# EAGLE design arpie_max (EAGLE 5.10)

## Sheet 1 of 3
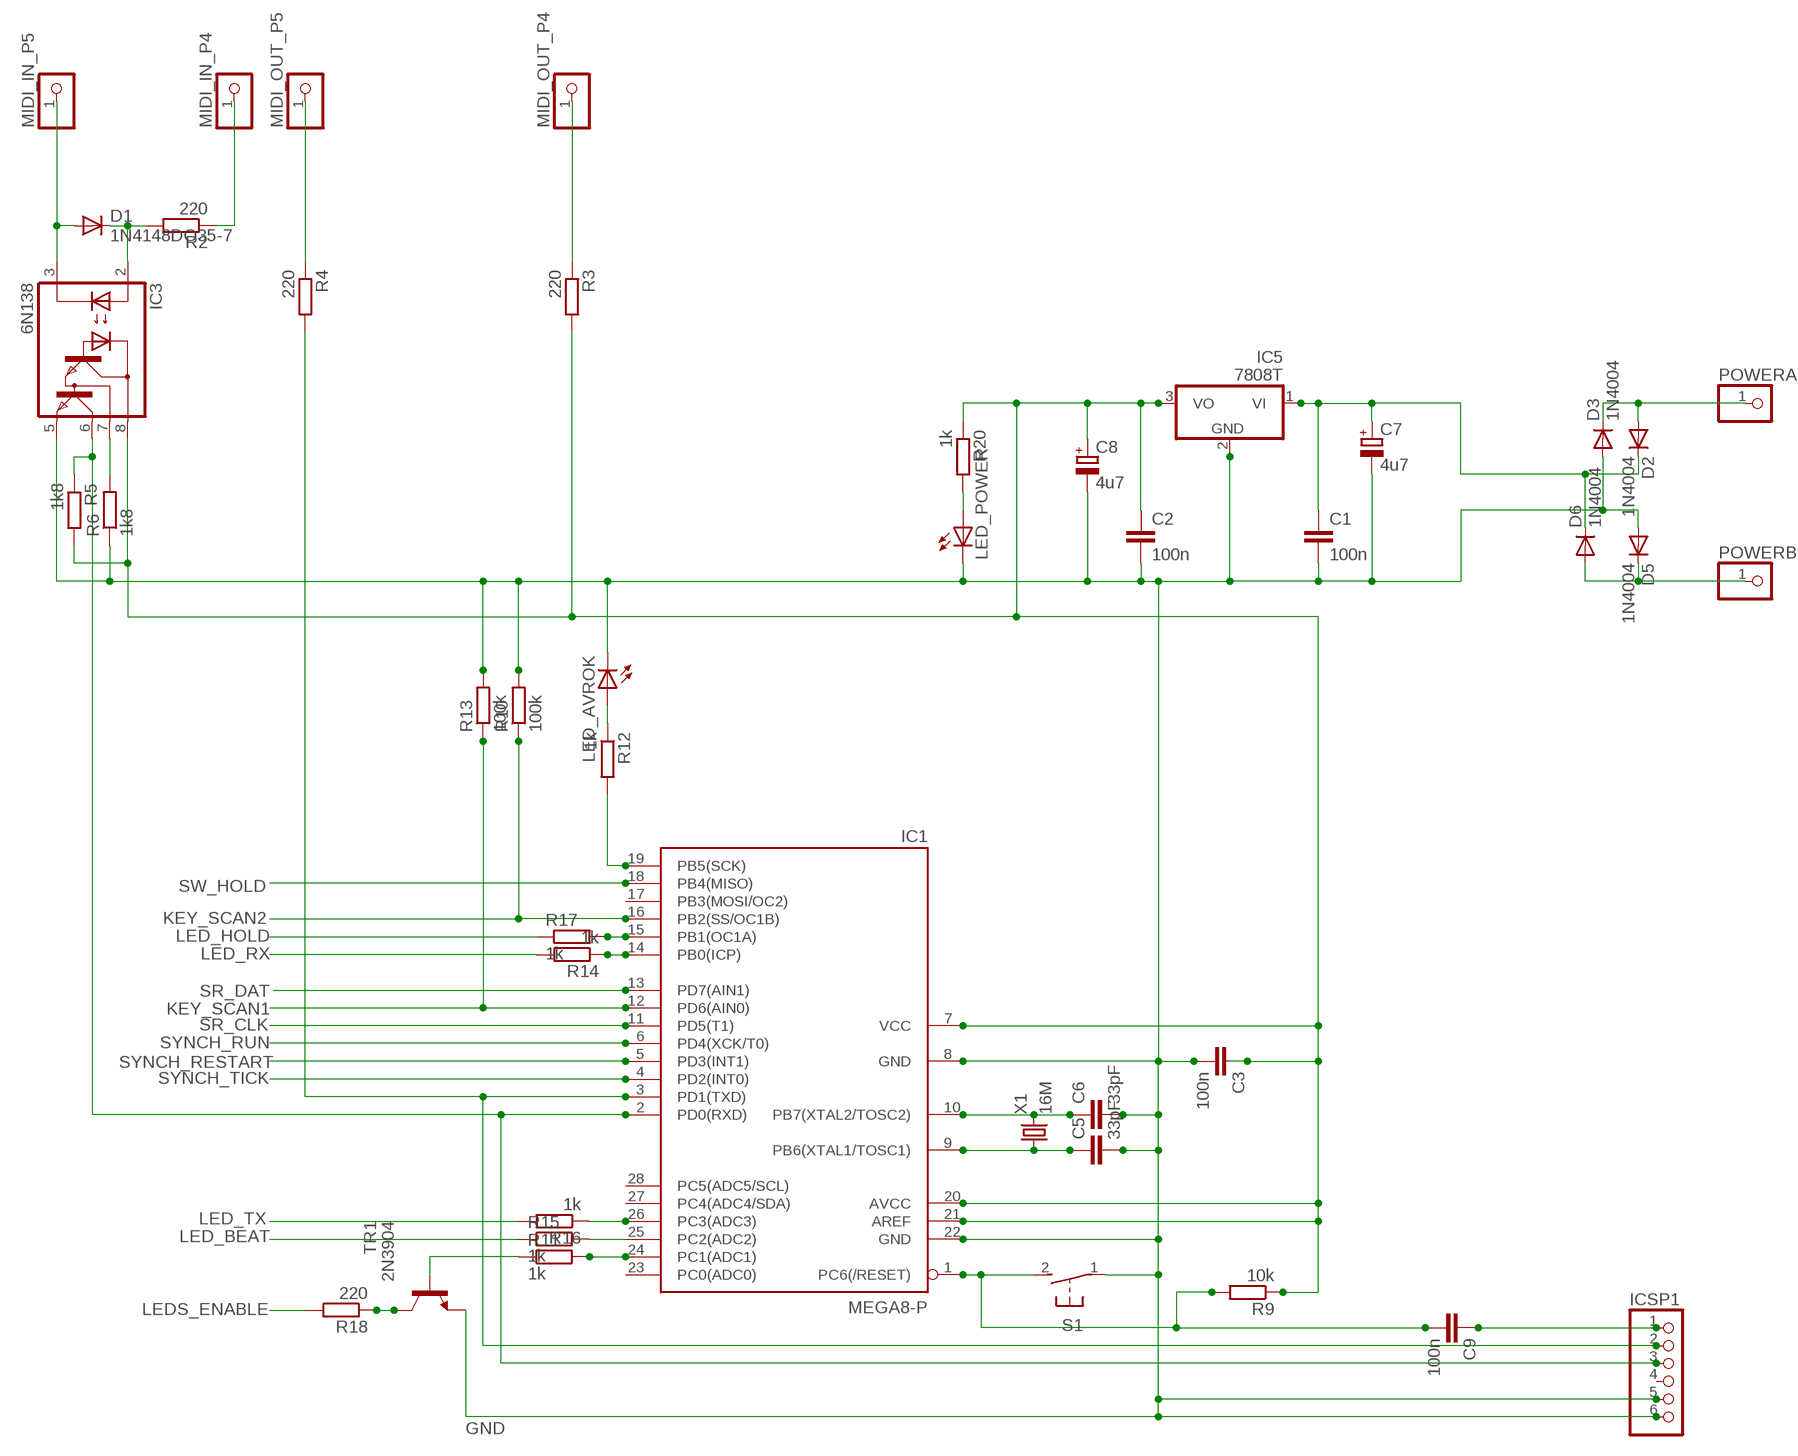
[diagram p0: schematic, sheet 1]

### Parts
C1  100n  C-EU025-024X044  [C025-024X044]
C2  100n  C-EU025-024X044  [C025-024X044]
C3  100n  C-EU025-024X044  [C025-024X044]
C5  33pF  C-EU025-024X044  [C025-024X044]
C6  33pF  C-EU025-024X044  [C025-024X044]
C7  4u7  CPOL-EUE2.5-7  [E2,5-7]
C8  4u7  CPOL-EUE2.5-7  [E2,5-7]
C9  100n  C-EU025-024X044  [C025-024X044]
D1  1N4148DO35-7  [DO35-7]
D2  1N4004  [DO41-10]
D3  1N4004  [DO41-10]
D5  1N4004  [DO41-10]
D6  1N4004  [DO41-10]
IC1  MEGA8-P  [DIL28-3]
IC3  6N138  [DIL08]
IC5  7808T  [TO220H]
ICSP1  PINHD-1X6  [1X06]
LED_AVROK  LED3MM  [LED3MM]
LED_POWER  LED5MM  [LED5MM]
MIDI_IN_P4  PINHD-1X1  [1X01]
MIDI_IN_P5  PINHD-1X1  [1X01]
MIDI_OUT_P4  PINHD-1X1  [1X01]
MIDI_OUT_P5  PINHD-1X1  [1X01]
POWERA  PINHD-1X1  [1X01]
POWERB  PINHD-1X1  [1X01]
R2  220  R-EU_0207/7  [0207/7]
R3  220  R-EU_0207/7  [0207/7]
R4  220  R-EU_0207/7  [0207/7]
R5  1k8  R-EU_0207/7  [0207/7]
R6  1k8  R-EU_0207/7  [0207/7]
R9  10k  R-EU_0207/7  [0207/7]
R10  100k  R-EU_0207/7  [0207/7]
R11  1k  R-EU_0207/7  [0207/7]
R12  1k  R-EU_0207/7  [0207/7]
R13  100k  R-EU_0207/7  [0207/7]
R14  1k  R-EU_0207/7  [0207/7]
R15  1k  R-EU_0207/7  [0207/7]
R16  1k  R-EU_0207/7  [0207/7]
R17  1k  R-EU_0207/7  [0207/7]
R18  220  R-EU_0207/7  [0207/7]
R20  1k  R-EU_0207/7  [0207/7]
S1  31-XX  [B3F-31XX]
TR1  2N3904  [TO92]
X1  16M  CRYSTALHC49S  [HC49/S]

### Nets
GND: C1.2 C2.2 C3.2 C5.2 C6.2 C7.- C8.- D3.A D5.A IC1.8(GND) IC1.22(GND) IC3.5(GND) IC5.2(GND) ICSP1.5 ICSP1.6 LED_AVROK.K(C) LED_POWER.K(C) R6.1 R10.2 R13.2 S1.1(P) TR1.3(E) ; also sheet 2,3
KEY_SCAN1: IC1.12(PD6(AIN0)) R13.1 ; also sheet 2
KEY_SCAN2: IC1.16(PB2(SS/OC1B)) R10.1 ; also sheet 2
LED_BEAT: R15.1 ; also sheet 2
LED_HOLD: R17.1 ; also sheet 2
LED_RX: R14.2 ; also sheet 2
LED_TX: R16.2 ; also sheet 2
LEDS_ENABLE: R18.2 ; also sheet 2
N$1: D1.A IC3.3(C) MIDI_IN_P5.1
N$2: D1.C IC3.2(A) R2.2
N$3: MIDI_IN_P4.1 R2.1
N$4: R11.1 TR1.2(B)
N$5: D5.C D6.A POWERB.1
N$6: IC1.25(PC2(ADC2)) R15.2
N$7: IC1.2(PD0(RXD)) IC3.6(VO) ICSP1.3 R5.1
N$8: IC3.7(VB) R6.2
N$9: C9.1 ICSP1.1
N$11: MIDI_OUT_P5.1 R4.1
N$12: IC1.3(PD1(TXD)) ICSP1.2 R4.2
N$13: MIDI_OUT_P4.1 R3.1
N$14: R18.1 TR1.1(C)
N$19: LED_POWER.A R20.2
N$35: IC1.26(PC3(ADC3)) R16.1
N$36: C6.1 IC1.10(PB7(XTAL2/TOSC2)) X1.2
N$37: C5.1 IC1.9(PB6(XTAL1/TOSC1)) X1.1
N$38: C9.2 IC1.1(PC6(/RESET)) R9.2 S1.2(S)
N$43: IC1.24(PC1(ADC1)) R11.2
N$44: IC1.14(PB0(ICP)) R14.1
N$48: IC1.19(PB5(SCK)) R12.2
N$50: LED_AVROK.A R12.1
N$54: D2.A D3.C POWERA.1
N$55: IC1.15(PB1(OC1A)) R17.2
SR_CLK: IC1.11(PD5(T1)) ; also sheet 2
SR_DAT: IC1.13(PD7(AIN1)) ; also sheet 2
SW_HOLD: IC1.18(PB4(MISO)) ; also sheet 2
SYNCH_RESTART: IC1.5(PD3(INT1)) ; also sheet 3
SYNCH_RUN: IC1.6(PD4(XCK/T0)) ; also sheet 3
SYNCH_TICK: IC1.4(PD2(INT0)) ; also sheet 3
VCC: C2.1 C3.1 C8.+ IC1.7(VCC) IC1.20(AVCC) IC1.21(AREF) IC3.8(VCC) IC5.3(VO) R3.2 R5.2 R9.1 R20.1 ; also sheet 2,3
VIN: C1.1 C7.+ D2.C D6.C IC5.1(VI)
Unconnected: IC1.17(PB3(MOSI/OC2)) IC1.23(PC0(ADC0)) IC1.27(PC4(ADC4/SDA)) IC1.28(PC5(ADC5/SCL)) ICSP1.4

## Sheet 2 of 3
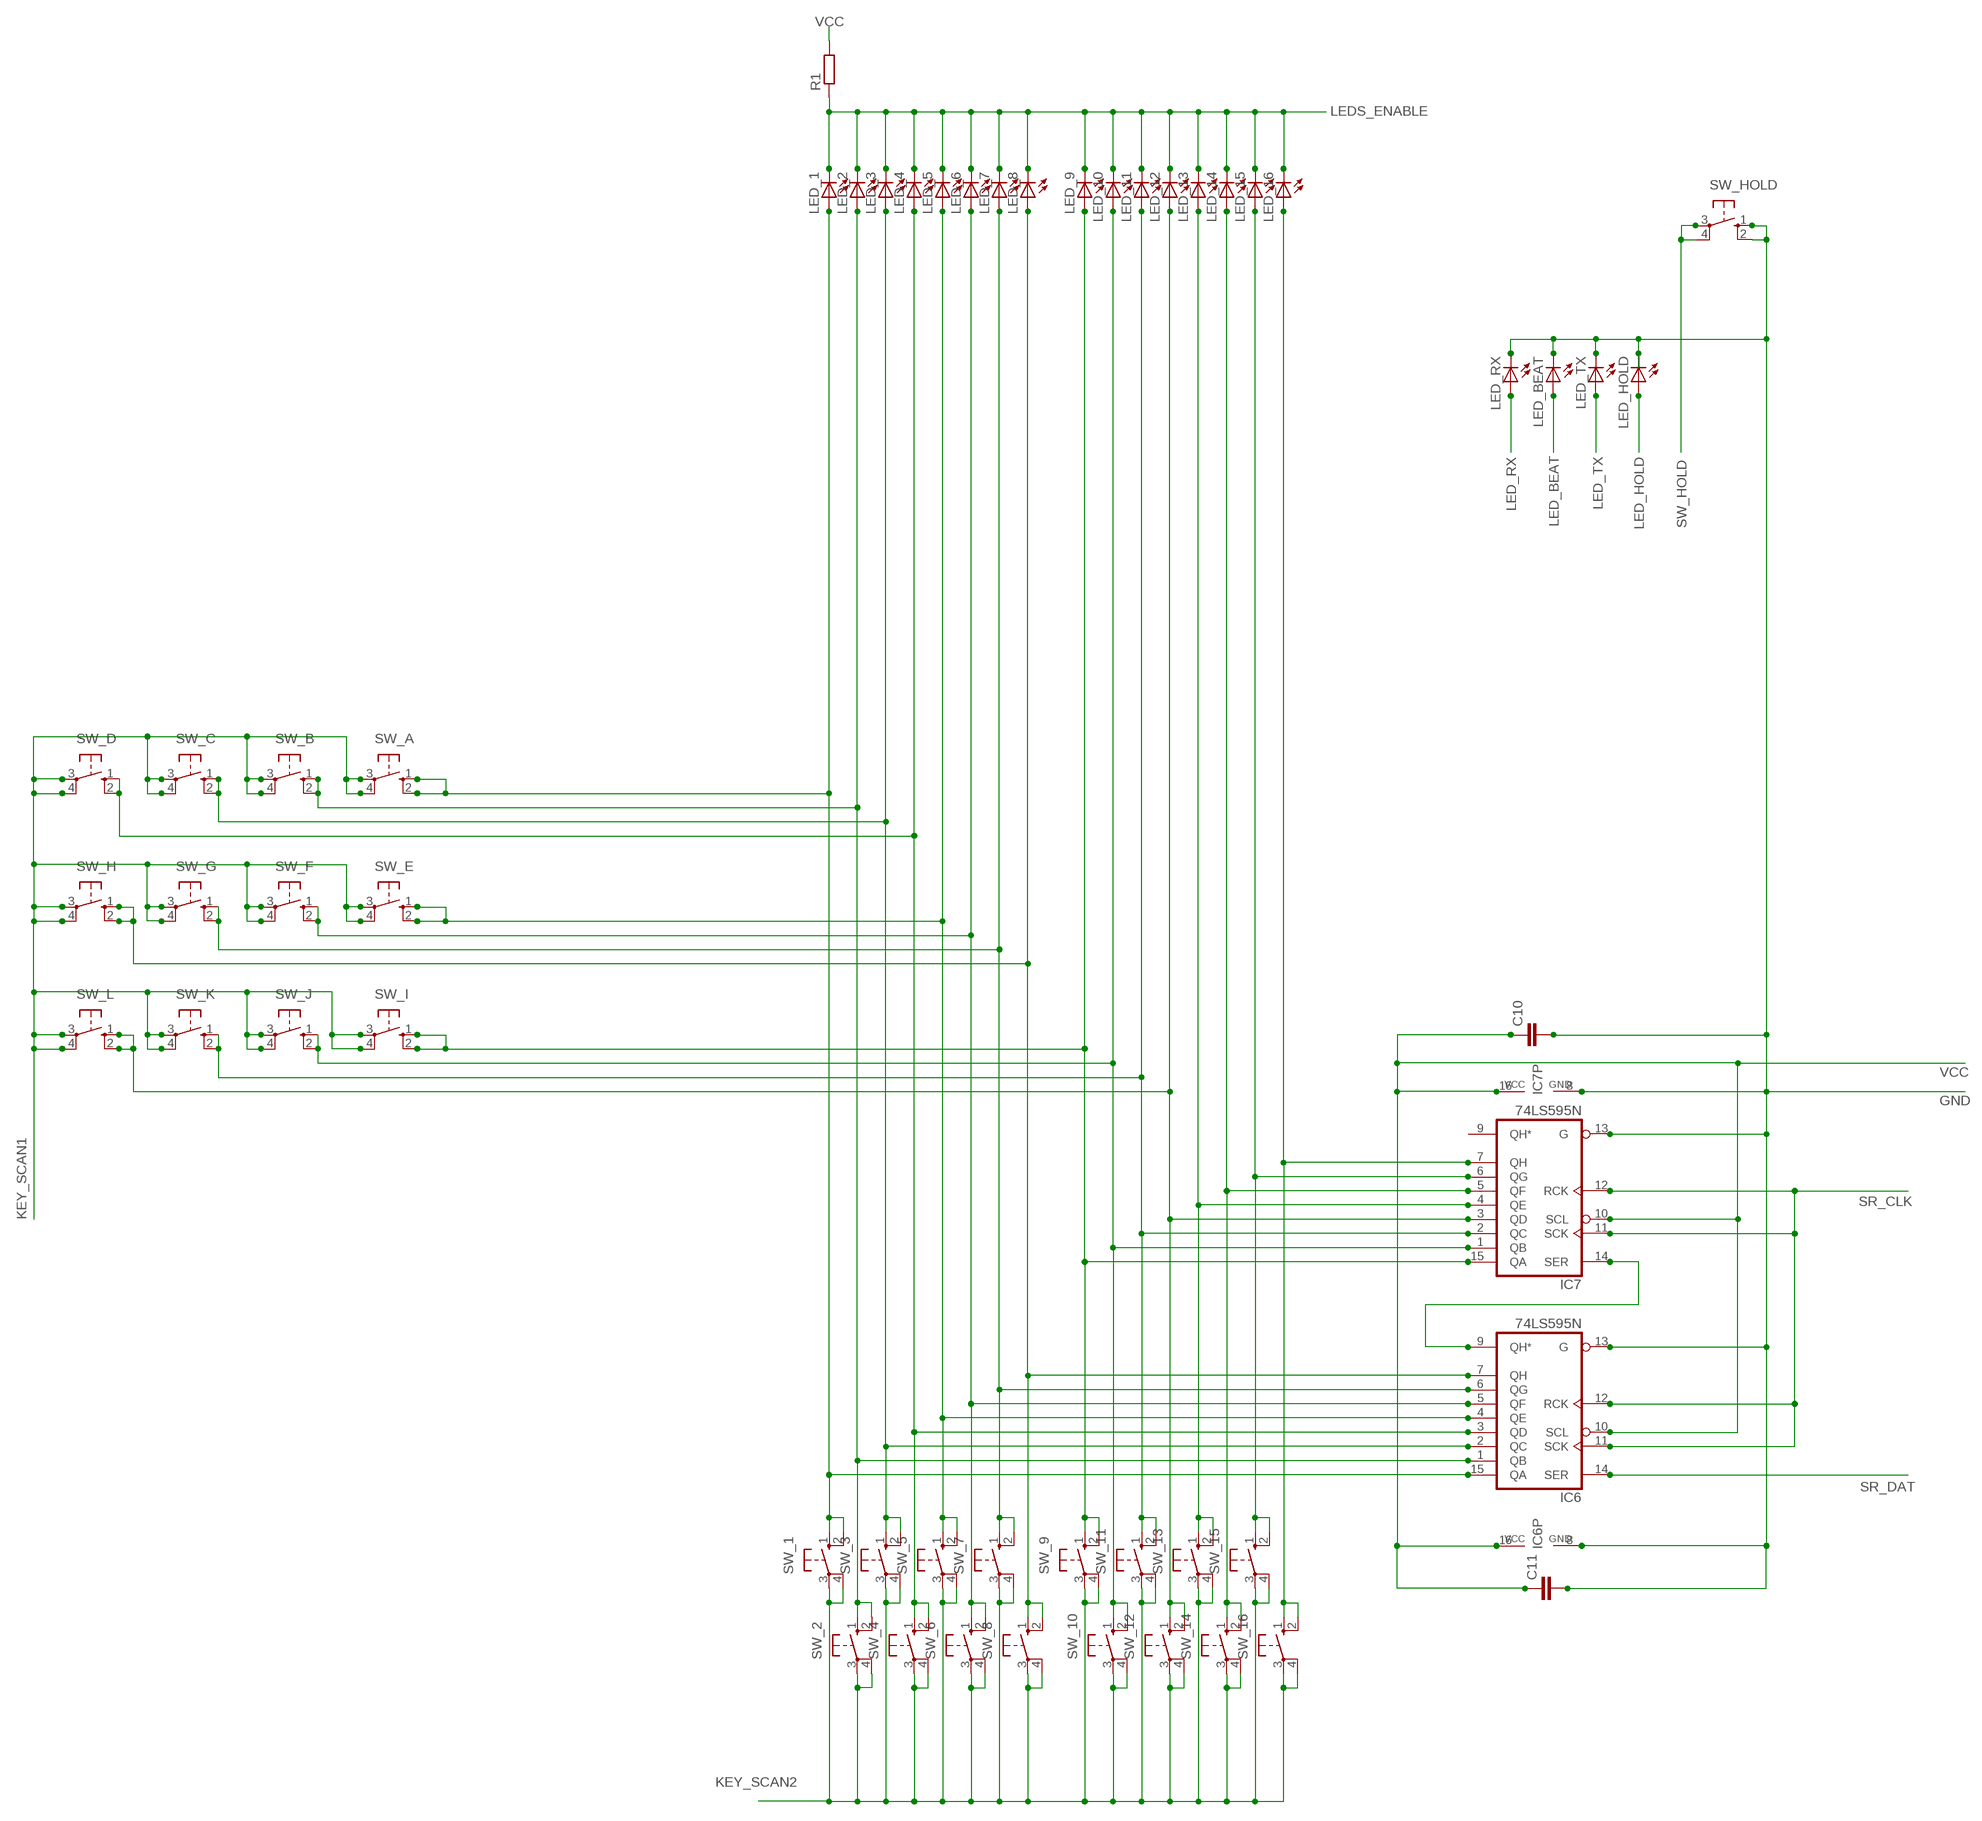
[diagram p1: schematic, sheet 2]

### Parts
C10  C-EU025-025X050  [C025-025X050]
C11  C-EU025-025X050  [C025-025X050]
IC6  74LS595N  [DIL16]
IC7  74LS595N  [DIL16]
LED_1  LED5MM  [LED5MM]
LED_2  LED5MM  [LED5MM]
LED_3  LED5MM  [LED5MM]
LED_4  LED5MM  [LED5MM]
LED_5  LED5MM  [LED5MM]
LED_6  LED5MM  [LED5MM]
LED_7  LED5MM  [LED5MM]
LED_8  LED5MM  [LED5MM]
LED_9  LED5MM  [LED5MM]
LED_10  LED5MM  [LED5MM]
LED_11  LED5MM  [LED5MM]
LED_12  LED5MM  [LED5MM]
LED_13  LED5MM  [LED5MM]
LED_14  LED5MM  [LED5MM]
LED_15  LED5MM  [LED5MM]
LED_16  LED5MM  [LED5MM]
LED_BEAT  LED5MM  [LED5MM]
LED_HOLD  LED5MM  [LED5MM]
LED_RX  LED5MM  [LED5MM]
LED_TX  LED5MM  [LED5MM]
R1  R-EU_0207/7  [0207/7]
SW_1  10-XX  [B3F-10XX]
SW_2  10-XX  [B3F-10XX]
SW_3  10-XX  [B3F-10XX]
SW_4  10-XX  [B3F-10XX]
SW_5  10-XX  [B3F-10XX]
SW_6  10-XX  [B3F-10XX]
SW_7  10-XX  [B3F-10XX]
SW_8  10-XX  [B3F-10XX]
SW_9  10-XX  [B3F-10XX]
SW_10  10-XX  [B3F-10XX]
SW_11  10-XX  [B3F-10XX]
SW_12  10-XX  [B3F-10XX]
SW_13  10-XX  [B3F-10XX]
SW_14  10-XX  [B3F-10XX]
SW_15  10-XX  [B3F-10XX]
SW_16  10-XX  [B3F-10XX]
SW_A  40-XX  [B3F-40XX]
SW_B  40-XX  [B3F-40XX]
SW_C  40-XX  [B3F-40XX]
SW_D  40-XX  [B3F-40XX]
SW_E  40-XX  [B3F-40XX]
SW_F  40-XX  [B3F-40XX]
SW_G  40-XX  [B3F-40XX]
SW_H  40-XX  [B3F-40XX]
SW_HOLD  40-XX  [B3F-40XX]
SW_I  40-XX  [B3F-40XX]
SW_J  40-XX  [B3F-40XX]
SW_K  40-XX  [B3F-40XX]
SW_L  40-XX  [B3F-40XX]

### Nets
GND: C10.2 C11.2 IC6.8(GND) IC6.13(G) IC7.8(GND) IC7.13(G) LED_BEAT.K(C) LED_HOLD.K(C) LED_RX.K(C) LED_TX.K(C) SW_HOLD.1(S) SW_HOLD.2(S1) ; also sheet 1,3
KEY_SCAN1: SW_A.3(P) SW_A.4(P1) SW_B.3(P) SW_B.4(P1) SW_C.3(P) SW_C.4(P1) SW_D.3(P) SW_D.4(P1) SW_E.3(P) SW_E.4(P1) SW_F.3(P) SW_F.4(P1) SW_G.3(P) SW_G.4(P1) SW_H.3(P) SW_H.4(P1) SW_I.3(P) SW_I.4(P1) SW_J.3(P) SW_J.4(P1) SW_K.3(P) SW_K.4(P1) SW_L.3(P) SW_L.4(P1) ; also sheet 1
KEY_SCAN2: SW_1.3(P) SW_1.4(P1) SW_2.3(P) SW_2.4(P1) SW_3.3(P) SW_3.4(P1) SW_4.3(P) SW_4.4(P1) SW_5.3(P) SW_5.4(P1) SW_6.3(P) SW_6.4(P1) SW_7.3(P) SW_7.4(P1) SW_8.3(P) SW_8.4(P1) SW_9.3(P) SW_9.4(P1) SW_10.3(P) SW_10.4(P1) SW_11.3(P) SW_11.4(P1) SW_12.3(P) SW_12.4(P1) SW_13.3(P) SW_13.4(P1) SW_14.3(P) SW_14.4(P1) SW_15.3(P) SW_15.4(P1) SW_16.3(P) SW_16.4(P1) ; also sheet 1
LED_BEAT: LED_BEAT.A ; also sheet 1
LED_HOLD: LED_HOLD.A ; also sheet 1
LED_RX: LED_RX.A ; also sheet 1
LED_TX: LED_TX.A ; also sheet 1
LEDS_ENABLE: LED_1.K(C) LED_2.K(C) LED_3.K(C) LED_4.K(C) LED_5.K(C) LED_6.K(C) LED_7.K(C) LED_8.K(C) LED_9.K(C) LED_10.K(C) LED_11.K(C) LED_12.K(C) LED_13.K(C) LED_14.K(C) LED_15.K(C) LED_16.K(C) R1.1 ; also sheet 1
N$17: IC6.15(QA) LED_1.A SW_1.1(S) SW_1.2(S1) SW_A.1(S) SW_A.2(S1)
N$20: IC6.1(QB) LED_2.A SW_2.1(S) SW_2.2(S1) SW_B.1(S) SW_B.2(S1)
N$21: IC6.2(QC) LED_3.A SW_3.1(S) SW_3.2(S1) SW_C.1(S) SW_C.2(S1)
N$22: IC6.3(QD) LED_4.A SW_4.1(S) SW_4.2(S1) SW_D.1(S) SW_D.2(S1)
N$23: IC6.4(QE) LED_5.A SW_5.1(S) SW_5.2(S1) SW_E.1(S) SW_E.2(S1)
N$24: IC6.5(QF) LED_6.A SW_6.1(S) SW_6.2(S1) SW_F.1(S) SW_F.2(S1)
N$25: IC6.6(QG) LED_7.A SW_7.1(S) SW_7.2(S1) SW_G.1(S) SW_G.2(S1)
N$26: IC6.7(QH) LED_8.A SW_8.1(S) SW_8.2(S1) SW_H.1(S) SW_H.2(S1)
N$27: IC7.15(QA) LED_9.A SW_9.1(S) SW_9.2(S1) SW_I.1(S) SW_I.2(S1)
N$28: IC7.1(QB) LED_10.A SW_10.1(S) SW_10.2(S1) SW_J.1(S) SW_J.2(S1)
N$29: IC7.3(QD) LED_12.A SW_12.1(S) SW_12.2(S1) SW_L.1(S) SW_L.2(S1)
N$30: IC7.2(QC) LED_11.A SW_11.1(S) SW_11.2(S1) SW_K.1(S) SW_K.2(S1)
N$31: IC6.9(QH*) IC7.14(SER)
N$32: IC7.4(QE) LED_13.A SW_13.1(S) SW_13.2(S1)
N$34: IC7.5(QF) LED_14.A SW_14.1(S) SW_14.2(S1)
N$39: IC7.6(QG) LED_15.A SW_15.1(S) SW_15.2(S1)
N$40: IC7.7(QH) LED_16.A SW_16.1(S) SW_16.2(S1)
SR_CLK: IC6.11(SCK) IC6.12(RCK) IC7.11(SCK) IC7.12(RCK) ; also sheet 1
SR_DAT: IC6.14(SER) ; also sheet 1
SW_HOLD: SW_HOLD.3(P) SW_HOLD.4(P1) ; also sheet 1
VCC: C10.1 C11.1 IC6.10(SCL) IC6.16(VCC) IC7.10(SCL) IC7.16(VCC) R1.2 ; also sheet 1,3
Unconnected: IC7.9(QH*)

## Sheet 3 of 3
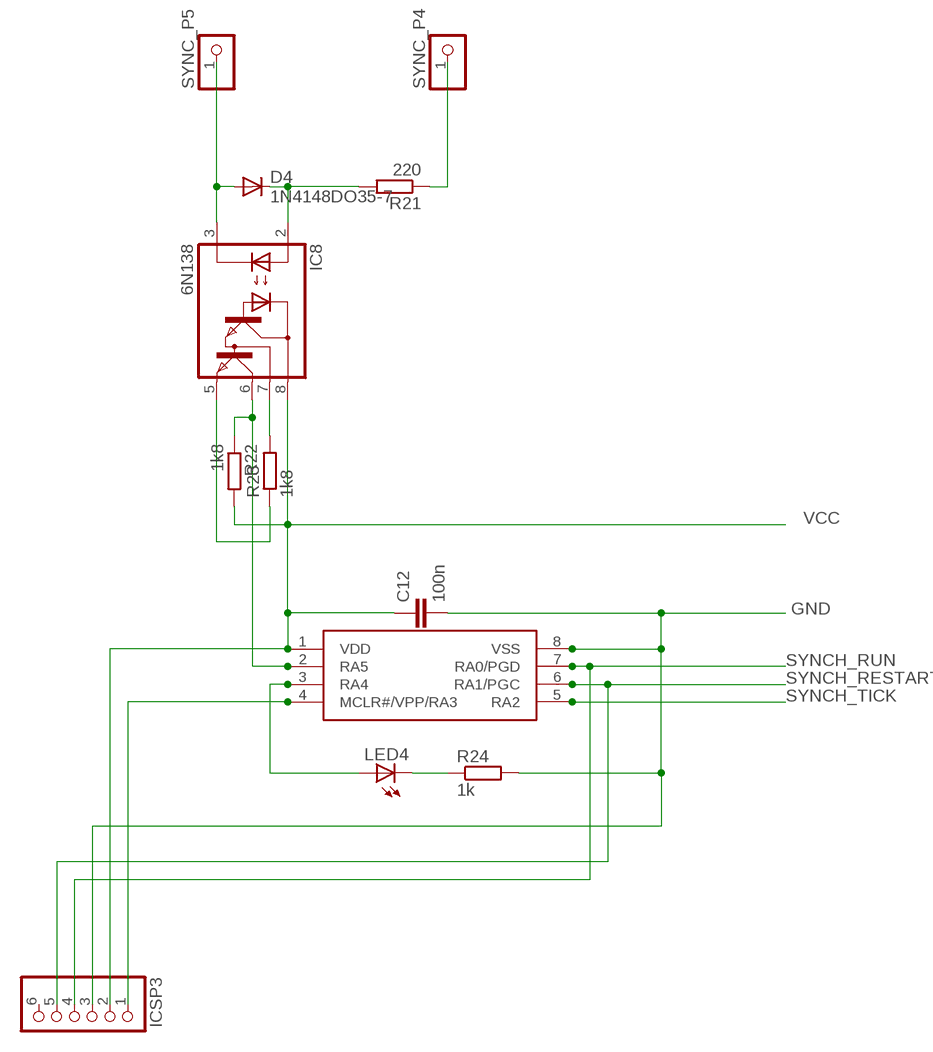
[diagram p2: schematic, sheet 3]

### Parts
C12  100n  C-EU025-024X044  [C025-024X044]
D4  1N4148DO35-7  [DO35-7]
IC8  6N138  [DIL08]
IC9  PIC12F1822  [DIL08]
ICSP3  PINHD-1X6  [1X06]
LED4  LED3MM  [LED3MM]
R21  220  R-EU_0207/7  [0207/7]
R22  1k8  R-EU_0207/7  [0207/7]
R23  1k8  R-EU_0207/7  [0207/7]
R24  1k  R-EU_0207/7  [0207/7]
SYNC_P4  PINHD-1X1  [1X01]
SYNC_P5  PINHD-1X1  [1X01]

### Nets
GND: C12.2 IC9.8(VSS) ICSP3.3 R24.2 ; also sheet 1,2
N$46: D4.A IC8.3(C) SYNC_P5.1
N$47: D4.C IC8.2(A) R21.2
N$49: R21.1 SYNC_P4.1
N$51: IC8.7(VB) R23.2
N$53: LED4.K(C) R24.1
N$57: IC8.6(VO) IC9.2(RA5) R22.1
N$58: IC9.3(RA4) LED4.A
N$59: IC9.4(MCLR#/VPP/RA3) ICSP3.1
N$60: IC8.5(GND) R23.1
SYNCH_RESTART: IC9.6(RA1/PGC) ICSP3.5 ; also sheet 1
SYNCH_RUN: IC9.7(RA0/PGD) ICSP3.4 ; also sheet 1
SYNCH_TICK: IC9.5(RA2) ; also sheet 1
VCC: C12.1 IC8.8(VCC) IC9.1(VDD) ICSP3.2 R22.2 ; also sheet 1,2
Unconnected: ICSP3.6

## Library data of the parts
C1-C3 C5 C6 C9-C12 = rcl:C-EU: CAPACITOR, European symbol
C7 C8 = rcl:CPOL-EU: POLARIZED CAPACITOR, European symbol
D1 D4 = diode:1N4148: DIODE high speed (Philips)
D2 D3 D5 D6 = adafruit:1N4004: DIODE General purpose 1N400x type rectifier (With bigger pads) http://www.ladyada.net/library/pcb/eaglelibrary.html
IC1 = atmel:MEGA8-P: MICROCONTROLLER 8 Kbytes FLASH, 1 kbytes SRAM, 512 bytes EEPROM, USART, 4-channel 10 bit ADC, 2-channel 8 bit ADC Pin compatible with Atmega48, ATMega88, ATMega168 Source: avr.lbr
IC3 IC8 = optocoupler:6N138: MOTOROLA OPTO COUPLER
IC5 = linear:78*: Positive VOLTAGE REGULATOR Source: http://cache.national.com/ds/LM/LM78L05.pdf http://www.fairchildsemi.com/ds/LM/LM7805.pdf
IC6 IC7 = 74xx-eu:74*595: 8-bit SHIFT REGISTER, output latch
IC9 = jasons_stuff:PIC12F1822
ICSP1 ICSP3 = adafruit:PINHD-1X6: PIN HEADER
LED4 LED_1-LED_16 LED_BEAT LED_HOLD LED_POWER LED_RX LED_TX = adafruit:LED: LED
LED_AVROK = led:LED: LED
MIDI_IN_P4 MIDI_IN_P5 MIDI_OUT_P4 MIDI_OUT_P5 POWERA POWERB = adafruit:PINHD-1X1: Pin header 1x1 for 0.1" spacing With round pins
R1-R6 R9-R18 R20-R24 = rcl:R-EU_: RESISTOR, European symbol
S1 = switch-omron:31-XX: OMRON SWITCH
SW_1-SW_16 = switch-omron:10-XX: OMRON SWITCH
SW_A SW_B SW_C SW_D SW_E SW_F SW_G SW_H SW_HOLD SW_I SW_J SW_K SW_L = switch-omron:40-XX: OMRON SWITCH
SYNC_P4 SYNC_P5 = pinhead:PINHD-1X1: PIN HEADER
TR1 = transistor:2N3904: NPN TRANSISTOR
X1 = crystal:CRYSTAL: CRYSTAL

## Board
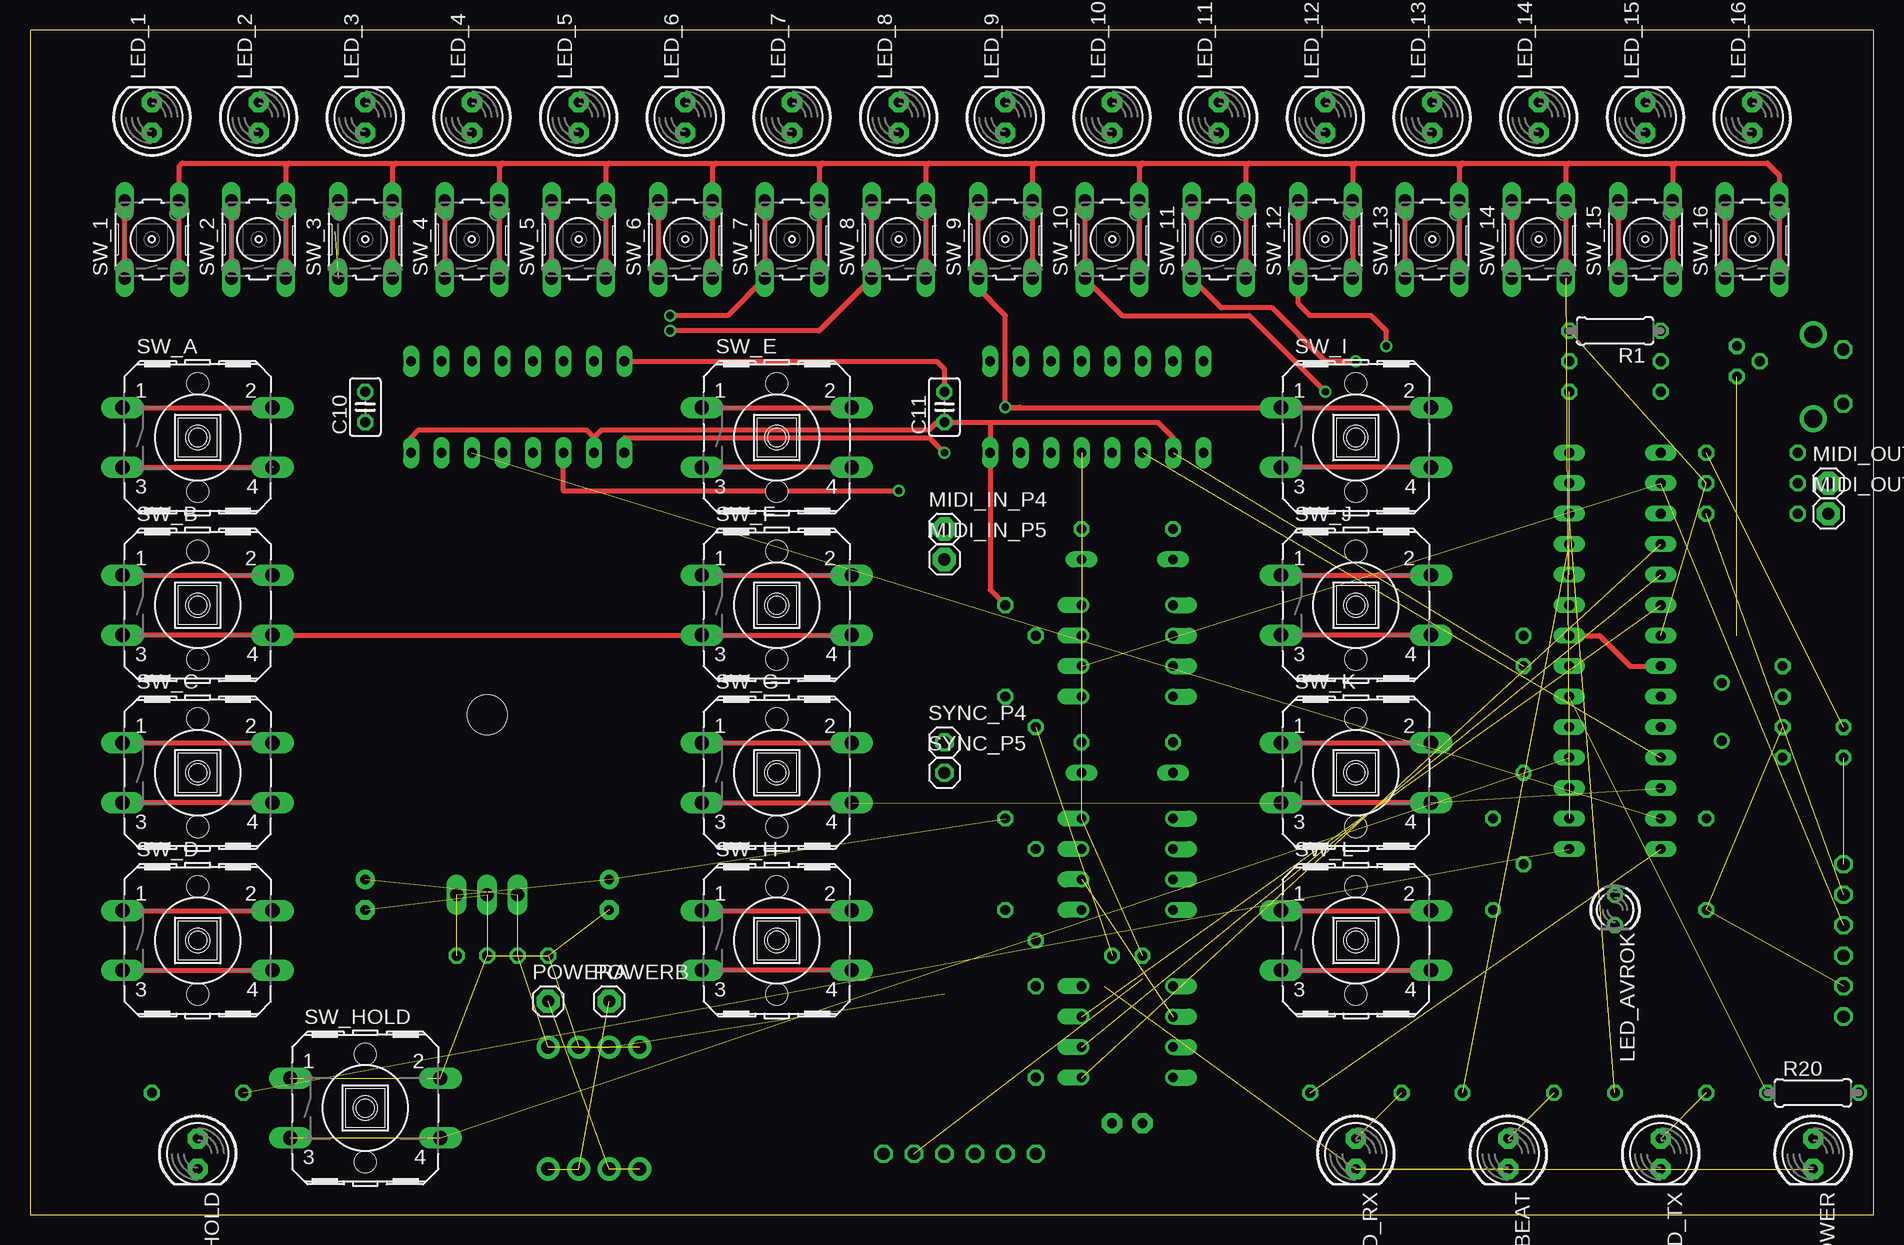
[diagram p3: board, top side]
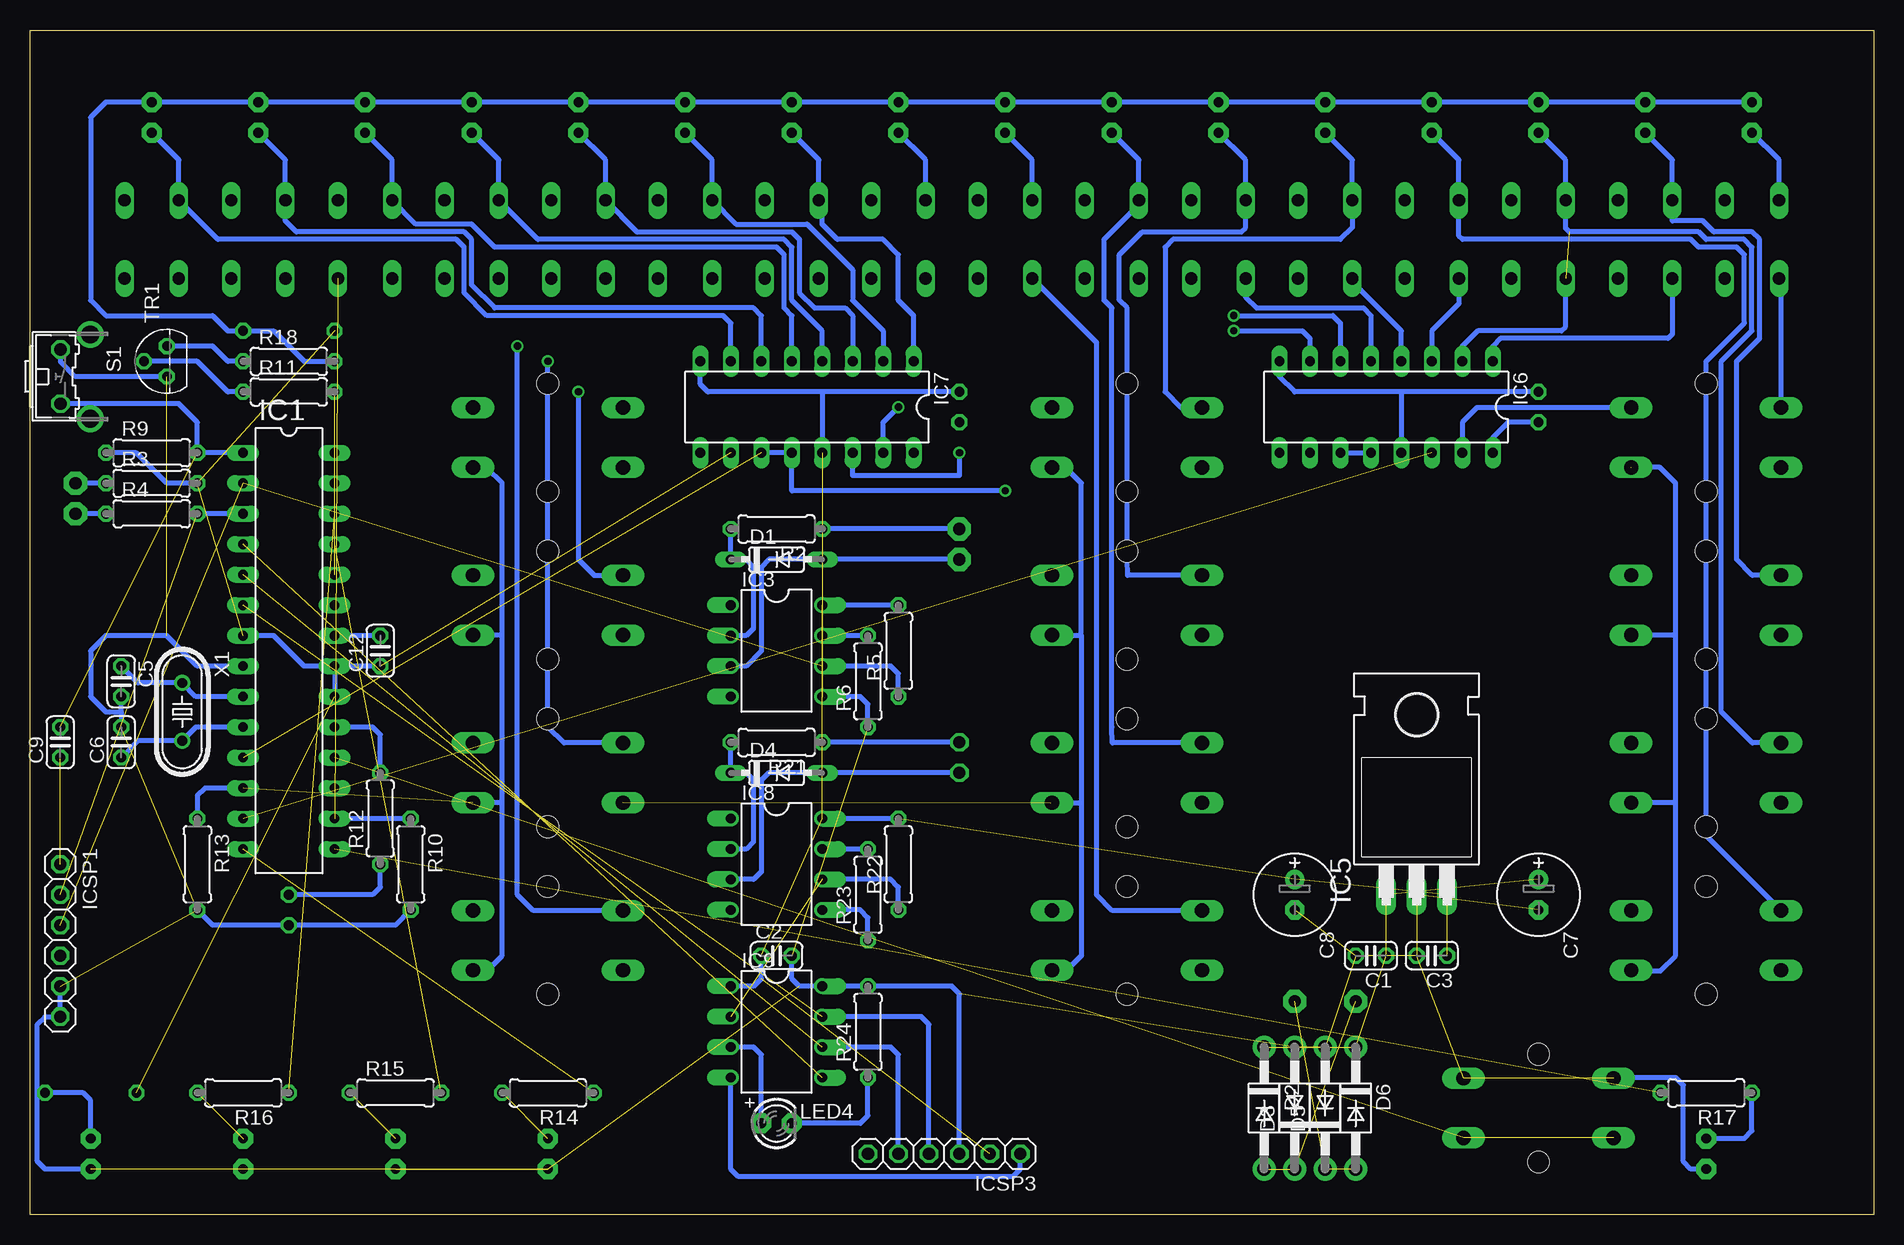
[diagram p4: board, bottom side, seen from below]

Size 153.65 x 98.73 mm. Coordinates in mm from the lower left corner, seen from the top.
Outline: 0,0 153.65,0 153.65,98.73 0,98.73 0,0
Copper layers (1*16): Top 0.035mm / dielectric 1.5mm / Bottom 0.035mm
Design rules "default": minimum track width 10mil, minimum drill 24mil, track to track 8mil, track to pad 8mil, pad to pad 8mil, via to via 8mil, smd to smd 8mil, copper to edge 40mil, drill to drill 8mil, minimum pad ring 10mil, minimum via ring 8mil, stop-mask expansion 4mil, vias tented up to drill 0mil, thermal gap 10mil

### Footprints (pad centres in the part's own frame; a part is rotated, then mirrored left to right if it is on the bottom)
C025-024X044 = drill 0.813 octagon: 1 -1.27,0; 2 1.27,0
E2,5-7 = drill 0.813 pad 1.6 round: + -1.27,0 | drill 0.813 pad 1.6 octagon: - 1.27,0
C025-025X050 = drill 0.813 octagon: 1 -1.27,0; 2 1.27,0
DO35-7 = drill 0.813 long: A 3.81,0; C -3.81,0
DO41-10 = drill 1.118 pad 1.93 round: A 5.08,0; C -5.08,0
DIL28-3 = drill 0.813 long: 1 -16.51,-3.81; 2 -13.97,-3.81; 3 -11.43,-3.81; 4 -8.89,-3.81; 5 -6.35,-3.81; 6 -3.81,-3.81; 7 -1.27,-3.81; 8 1.27,-3.81; 9 3.81,-3.81; 10 6.35,-3.81; 11 8.89,-3.81; 12 11.43,-3.81; 13 13.97,-3.81; 14 16.51,-3.81; 15 16.51,3.81; 16 13.97,3.81; 17 11.43,3.81; 18 8.89,3.81; 19 6.35,3.81; 20 3.81,3.81; 21 1.27,3.81; 22 -1.27,3.81; 23 -3.81,3.81; 24 -6.35,3.81; 25 -8.89,3.81; 26 -11.43,3.81; 27 -13.97,3.81; 28 -16.51,3.81
DIL08 = drill 0.813 offset: 1 -3.81,-3.81; 2 -1.27,-3.81; 3 1.27,-3.81; 4 3.81,-3.81; 5 3.81,3.81; 6 1.27,3.81; 7 -1.27,3.81; 8 -3.81,3.81
TO220H = drill 1.118 long: 1 -2.54,-10.16; 2 0,-10.16; 3 2.54,-10.16 | hole 3.302: 0,4.826
DIL16 = drill 0.813 long: 1 -8.89,-3.81; 2 -6.35,-3.81; 3 -3.81,-3.81; 4 -1.27,-3.81; 5 1.27,-3.81; 6 3.81,-3.81; 7 6.35,-3.81; 8 8.89,-3.81; 9 8.89,3.81; 10 6.35,3.81; 11 3.81,3.81; 12 1.27,3.81; 13 -1.27,3.81; 14 -3.81,3.81; 15 -6.35,3.81; 16 -8.89,3.81
1X06 = drill 1.016 octagon: 1 -6.35,0; 2 -3.81,0; 3 -1.27,0; 4 1.27,0; 5 3.81,0; 6 6.35,0
LED3MM = drill 0.813 pad 1.676 octagon: A -1.27,0; K 1.27,0
LED5MM = drill 0.813 pad 1.676 octagon: A -1.27,0; K 1.27,0
LED3MM' = drill 0.813 octagon: A -1.27,0; K 1.27,0
1X01 = drill 1.016 pad 1.93 octagon: 1 0,0
0207/7 = drill 0.813 octagon: 1 -3.81,0; 2 3.81,0
B3F-31XX = drill 1.016 octagon: 1 -2.261,-1.245; 2 2.261,-1.245 | drill 1.499 pad 2.159 round: 3 -3.505,1.245; 4 3.505,1.245
B3F-10XX = drill 1.016 long: 1 -3.251,2.261; 2 3.251,2.261; 3 -3.251,-2.261; 4 3.251,-2.261
B3F-40XX = drill 1.194 long: 1 -6.248,2.489; 2 6.248,2.489; 3 -6.248,-2.489; 4 6.248,-2.489 | hole 1.803: 0,-4.496; 0,4.496
1X01' = drill 1.016 octagon: 1 0,0
TO92 = drill 0.813 octagon: 1 1.27,0; 2 0,1.905; 3 -1.27,0
HC49/S = drill 0.813 round: 1 -2.413,0; 2 2.413,0

### Placement (x,y rotation side)
C1  41.91,21.59 180 bottom
C2  91.44,21.59 0 bottom
C3  36.83,21.59 180 bottom
C5  146.05,44.45 270 bottom
C6  146.05,39.37 90 bottom
C7  27.94,26.67 270 bottom
C8  48.26,26.67 270 bottom
C9  151.13,39.37 90 bottom
C10  27.94,67.31 90 top
C11  76.2,67.31 90 top
C12  124.46,46.99 90 bottom
D1  91.44,54.61 0 bottom
D2  50.8,8.89 270 bottom
D3  48.26,8.89 90 bottom
D4  91.44,36.83 0 bottom
D5  45.72,8.89 90 bottom
D6  43.18,8.89 270 bottom
IC1  132.08,46.99 270 bottom
IC3  91.44,46.99 270 bottom
IC5  38.1,36.83 0 bottom
IC6  40.64,67.31 180 bottom
IC7  88.9,67.31 180 bottom
IC8  91.44,29.21 270 bottom
IC9  91.44,15.24 270 bottom
ICSP1  151.13,22.86 270 bottom
ICSP3  77.47,5.08 180 bottom
LED4  91.44,7.62 0 bottom
LED_1  10.16,91.44 90 top
LED_2  19.05,91.44 90 top
LED_3  27.94,91.44 90 top
LED_4  36.83,91.44 90 top
LED_5  45.72,91.44 90 top
LED_6  54.61,91.44 90 top
LED_7  63.5,91.44 90 top
LED_8  72.39,91.44 90 top
LED_9  81.28,91.44 90 top
LED_10  90.17,91.44 90 top
LED_11  99.06,91.44 90 top
LED_12  107.95,91.44 90 top
LED_13  116.84,91.44 90 top
LED_14  125.73,91.44 90 top
LED_15  134.62,91.44 90 top
LED_16  143.51,91.44 90 top
LED_AVROK  [LED3MM']  132.08,25.4 270 top
LED_BEAT  123.19,5.08 270 top
LED_HOLD  13.97,5.08 270 top
LED_POWER  148.59,5.08 270 top
LED_RX  110.49,5.08 270 top
LED_TX  135.89,5.08 270 top
MIDI_IN_P4  76.2,57.15 0 top
MIDI_IN_P5  76.2,54.61 0 top
MIDI_OUT_P4  149.86,60.96 0 top
MIDI_OUT_P5  149.86,58.42 0 top
POWERA  43.18,17.78 0 top
POWERB  48.26,17.78 0 top
R1  132.08,73.66 180 top
R2  91.44,57.15 180 bottom
R3  143.51,60.96 0 bottom
R4  143.51,58.42 0 bottom
R5  81.28,46.99 90 bottom
R6  83.82,44.45 90 bottom
R9  143.51,63.5 0 bottom
R10  121.92,29.21 270 bottom
R11  132.08,68.58 0 bottom
R12  124.46,33.02 90 bottom
R13  139.7,29.21 270 bottom
R14  110.49,10.16 180 bottom
R15  123.19,10.16 0 bottom
R16  135.89,10.16 180 bottom
R17  13.97,10.16 180 bottom
R18  132.08,71.12 0 bottom
R20  148.59,10.16 0 top
R21  91.44,39.37 180 bottom
R22  81.28,29.21 90 bottom
R23  83.82,26.67 90 bottom
R24  83.82,15.24 90 bottom
S1  149.86,69.85 270 bottom
SW_1  10.16,81.28 90 top
SW_2  19.05,81.28 90 top
SW_3  27.94,81.28 90 top
SW_4  36.83,81.28 90 top
SW_5  45.72,81.28 90 top
SW_6  54.61,81.28 90 top
SW_7  63.5,81.28 90 top
SW_8  72.39,81.28 90 top
SW_9  81.28,81.28 90 top
SW_10  90.17,81.28 90 top
SW_11  99.06,81.28 90 top
SW_12  107.95,81.28 90 top
SW_13  116.84,81.28 90 top
SW_14  125.73,81.28 90 top
SW_15  134.62,81.28 90 top
SW_16  143.51,81.28 90 top
SW_A  13.97,64.77 0 top
SW_B  13.97,50.8 0 top
SW_C  13.97,36.83 0 top
SW_D  13.97,22.86 0 top
SW_E  62.23,64.77 0 top
SW_F  62.23,50.8 0 top
SW_G  62.23,36.83 0 top
SW_H  62.23,22.86 0 top
SW_HOLD  27.94,8.89 0 top
SW_I  110.49,64.77 0 top
SW_J  110.49,50.8 0 top
SW_K  110.49,36.83 0 top
SW_L  110.49,22.86 0 top
SYNC_P4  [1X01']  76.2,39.37 0 top
SYNC_P5  [1X01']  76.2,36.83 0 top
TR1  142.24,71.12 90 bottom
X1  140.97,41.91 270 bottom

### Tracks (layer width: path | path; a pad name or v marks a point on that pad's centre or on a via)
GND  (18 unrouted)
  Top 0.406: IC1.22 130.81,48.26 133.35,45.72 IC1.8 | IC6.8 75.56,71.12 76.2,70.48 C11.2
  Bottom 0.406: C10.2 39.37,68.58 | 39.37,68.58 48.26,68.58 49.53,69.85 IC6.8 | 39.37,68.58 IC6.13 | IC3.5 84.45,43.18 83.82,42.55 R6.1 | C2.2 90.17,19.68 89.53,19.05 IC9.8 R24.2 76.83,19.05 76.2,18.41 ICSP3.3 | S1.1 151.1,71.09 149.86,69.85 TR1.3 | 146.05,41.91 C6.2 | 146.05,41.91 C5.2 | IC1.8 139.7,45.72 142.24,48.26 147.32,48.26 148.59,46.99 148.59,43.18 147.32,41.91 146.05,41.91 | LED_POWER.K 152.4,3.81 153.03,4.45 153.03,15.88 152.4,16.51 ICSP1.6 ICSP1.5 | R10.2 123.19,24.13 LED_AVROK.K 138.43,24.13 R13.2 | C12.2 IC1.22 | LED_HOLD.K 15.24,3.81 15.88,4.45 15.88,10.79 16.51,11.43 21.64,11.43 SW_HOLD.1 | IC7.8 97.79,69.22 97.16,68.58 87.63,68.58 | C11.2 87.63,68.58 | 87.63,68.58 IC7.13
KEY_SCAN1  (via drill 0.6)  (3 unrouted)
  Top 0.406: SW_E.4 SW_E.3 | SW_F.4 SW_F.3 SW_B.4 SW_B.3 | v68.58,34.29 56.03,34.29 SW_G.3 | SW_H.4 SW_H.3 | SW_A.3 20.27,62.28 20.32,62.23 21.59,62.23 | SW_C.4 SW_C.3 | SW_D.3 SW_D.4 | SW_I.3 115.52,62.28 115.57,62.23 116.69,62.23 SW_I.4 | SW_J.4 SW_J.3 | SW_K.4 SW_K.3 | SW_L.3 SW_L.4
  Bottom 0.406: SW_A.4 17.83,62.28 16.51,60.96 16.51,48.26 | 16.51,34.29 16.51,21.59 17.78,20.32 20.17,20.32 SW_D.4 | 16.51,34.29 16.51,48.26 | SW_B.4 16.56,48.31 16.51,48.26 | SW_C.4 16.56,34.34 16.51,34.29 | SW_E.4 67.36,62.28 66.04,60.96 66.04,48.26 | 66.04,34.29 66.04,21.59 67.31,20.32 68.43,20.32 SW_H.4 | 66.04,48.26 66.04,34.29 | SW_G.4 68.53,34.34 v68.58,34.29 66.04,34.29 | SW_L.4 115.52,20.37 114.3,21.59 114.3,34.29 | 114.3,34.29 114.3,48.26 | 114.3,48.26 114.3,60.96 115.57,62.23 116.69,62.23 SW_I.4 | SW_J.4 114.35,48.31 114.3,48.26 | SW_K.4 114.35,34.34 114.3,34.29 | R13.1 139.7,34.92 139.06,35.56 IC1.12 | SW_F.4 66.09,48.31 66.04,48.26
KEY_SCAN2  (1 unrouted)
  Top 0.406: 21.59,87.63 12.7,87.63 12.42,87.35 SW_1.4 SW_1.3 | 21.59,87.63 30.48,87.63 | 30.48,87.63 39.37,87.63 | 39.37,87.63 48.26,87.63 | 48.26,87.63 57.15,87.63 | 57.15,87.63 66.04,87.63 | 66.04,87.63 74.93,87.63 | 74.93,87.63 83.82,87.63 | 83.82,87.63 92.71,87.63 | 92.71,87.63 101.6,87.63 | 101.6,87.63 110.49,87.63 | 110.49,87.63 119.38,87.63 | 119.38,87.63 128.27,87.63 | 128.27,87.63 137.16,87.63 | 137.16,87.63 144.78,87.63 145.77,86.64 SW_16.4 SW_16.3 | 137.16,87.63 136.88,87.35 SW_15.4 SW_15.3 | 128.27,87.63 127.99,87.35 SW_14.4 SW_14.3 | 119.38,87.63 119.1,87.35 SW_13.4 SW_13.3 | 110.49,87.63 110.21,87.35 SW_12.4 SW_12.3 | 101.6,87.63 101.32,87.35 SW_11.4 SW_11.3 | 21.59,87.63 21.31,87.35 SW_2.4 SW_2.3 | 30.48,87.63 30.2,87.35 SW_3.4 SW_3.3 | 39.37,87.63 39.09,87.35 SW_4.4 SW_4.3 | 48.26,87.63 47.98,87.35 SW_5.4 SW_5.3 | 57.15,87.63 56.87,87.35 SW_6.4 SW_6.3 | 66.04,87.63 65.76,87.35 SW_7.4 SW_7.3 | 74.93,87.63 74.65,87.35 SW_8.4 SW_8.3 | 83.82,87.63 83.54,87.35 SW_9.4 SW_9.3 | 92.71,87.63 92.43,87.35 SW_10.4 SW_10.3
  Bottom 0.406: R10.1 IC1.16
LED_BEAT  (1 unrouted)
LED_HOLD
  Bottom 0.406: R17.1 10.16,6.99 10.79,6.35 LED_HOLD.A
LED_RX  (1 unrouted)
LED_TX  (1 unrouted)
LEDS_ENABLE
  Bottom 0.406: LED_1.K LED_2.K LED_3.K LED_4.K LED_5.K LED_6.K | LED_6.K 55.88,92.71 | LED_6.K LED_7.K LED_8.K LED_9.K LED_10.K LED_11.K LED_12.K LED_13.K LED_14.K LED_15.K LED_16.K 147.32,92.71 148.59,91.44 148.59,76.2 147.32,74.93 138.43,74.93 137.16,73.66 R1.1 133.35,73.66 130.81,71.12 R18.2
N$1
  Bottom 0.406: MIDI_IN_P5.1 D1.A 92.08,54.61 92.71,53.98 92.71,46.99 93.98,45.72 IC3.3
N$2
  Bottom 0.406: R2.2 D1.C 93.98,54.61 93.34,53.98 93.34,48.9 93.98,48.26 IC3.2
N$3
  Bottom 0.406: MIDI_IN_P4.1 R2.1
N$4
  Bottom 0.406: R11.1 137.16,68.58 139.7,71.12 TR1.2
N$5  (2 unrouted)
N$6  (1 unrouted)
N$7  (2 unrouted)
  Bottom 0.406: IC3.6 81.92,45.72 81.28,45.09 R5.1
N$8
  Bottom 0.406: R6.2 IC3.7
N$9  (1 unrouted)
N$11
  Bottom 0.406: R4.1 MIDI_OUT_P5.1
N$12  (1 unrouted)
  Bottom 0.406: IC1.3 R4.2
N$13
  Bottom 0.406: R3.1 MIDI_OUT_P4.1
N$14
  Bottom 0.406: R18.1 137.16,71.12 138.43,72.39 TR1.1
N$17
  Top 0.406: SW_A.1 SW_A.2 | SW_1.1 SW_1.2
  Bottom 0.406: SW_A.2 33.07,67.26 34.29,66.04 IC6.15 | SW_A.1 7.72,77.85 SW_1.1 | SW_1.2 7.9,87.91 LED_1.A
N$19
  Bottom 0.406: LED_POWER.A 148.59,9.53 149.22,10.16 R20.2
N$20
  Top 0.406: SW_B.1 SW_B.2 | SW_2.2 SW_2.1
  Bottom 0.406: LED_2.A 16.79,87.91 SW_2.2 16.79,82.83 14.25,82.83 13.34,81.92 10.16,81.92 9.53,81.28 9.53,73.03 11.43,71.12 11.43,54.61 10.11,53.29 SW_B.1 | IC6.1 31.75,72.39 31.11,73.03 17.14,73.03 16.79,73.38 SW_2.1
N$21  (1 unrouted)
  Top 0.406: SW_C.1 SW_C.2 | SW_C.1 6.4,39.32 6.35,39.37 7.67,39.37 SW_C.1
  Bottom 0.406: LED_3.A 25.68,87.91 SW_3.2 25.68,82.19 25.4,81.92 14.61,81.92 13.97,81.28 10.79,81.28 10.16,80.64 10.16,73.66 12.7,71.12 12.7,41.91 10.11,39.32 SW_C.1 | SW_3.1 25.68,74.02 26.04,73.66 33.02,73.66 34.29,72.39 IC6.2
N$22
  Top 0.406: SW_D.1 SW_D.2 | SW_4.2 SW_4.1
  Bottom 0.406: LED_4.A 34.57,87.91 SW_4.2 34.57,81.56 34.29,81.28 15.24,81.28 14.61,80.64 11.43,80.64 10.79,80.01 10.79,74.3 13.97,71.12 13.97,31.6 SW_D.1 | IC6.3 36.83,73.66 34.57,75.92 SW_4.1
N$23
  Top 0.406: SW_E.1 SW_E.2 | SW_5.1 SW_5.2
  Bottom 0.406: LED_5.A 43.46,87.91 SW_5.2 43.46,82.27 44.45,81.28 58.42,81.28 59.05,80.64 59.05,68.58 57.73,67.26 SW_E.1 | SW_5.1 43.46,77.75 39.37,73.66 IC6.4
N$24
  Top 0.406: SW_F.1 SW_F.2 | SW_6.2 SW_6.1
  Bottom 0.406: LED_6.A 52.35,87.91 SW_6.2 52.35,82.27 52.7,81.92 60.96,81.92 62.87,80.01 62.87,76.2 62.23,75.56 62.23,54.61 62.18,53.29 SW_F.1 | SW_6.1 52.35,76.48 51.44,75.56 42.55,75.56 41.91,74.93 IC6.5
N$25  (via drill 0.6)
  Top 0.406: v53.34,74.93 58.14,74.93 SW_7.1 SW_7.2 | SW_G.1 SW_G.2
  Bottom 0.406: LED_7.A 61.24,87.91 SW_7.2 61.24,84.18 64.14,81.28 64.14,76.2 63.5,75.56 63.5,40.64 63.45,39.32 SW_G.1 | IC6.6 44.45,74.3 45.09,74.93 v53.34,74.93
N$26  (via drill 0.6)
  Top 0.406: v53.34,73.66 65.76,73.66 SW_8.1 SW_8.2 | SW_H.1 SW_H.2
  Bottom 0.406: SW_8.2 70.13,87.91 LED_8.A | SW_H.1 63.45,25.35 64.77,26.67 64.77,72.67 SW_8.1 | IC6.7 46.99,73.03 47.62,73.66 v53.34,73.66
N$27  (via drill 0.6)
  Top 0.406: v81.28,67.31 81.28,74.93 79.02,77.19 SW_9.1 SW_9.2 | 82.55,67.26 81.33,67.26 v81.28,67.31 | 82.55,67.26 SW_I.1 SW_I.2 | v81.28,67.31 82.5,67.31 82.55,67.26
  Bottom 0.406: SW_9.2 79.02,87.91 LED_9.A | IC7.15 82.55,66.04 v81.28,67.31
N$28  (via drill 0.6)
  Top 0.406: v107.95,68.58 101.6,74.93 91.01,74.93 SW_10.1 SW_10.2 | SW_J.1 SW_J.2
  Bottom 0.406: IC7.1 80.01,74.93 81.28,76.2 81.28,80.01 82.55,81.28 86.36,81.28 87.63,82.55 87.63,84.25 SW_10.2 87.91,87.91 LED_10.A | SW_J.1 106.63,53.29 107.95,54.61 v107.95,68.58
N$29  (via drill 0.6)
  Top 0.406: v113.03,72.39 113.03,73.66 111.76,74.93 106.68,74.93 105.69,75.92 SW_12.1 SW_12.2 | SW_L.1 SW_L.2
  Bottom 0.406: IC7.3 85.09,74.93 85.72,75.56 88.27,75.56 89.53,76.83 89.53,81.28 90.17,81.92 103.07,81.92 SW_12.2 105.69,87.91 LED_12.A | SW_L.1 111.71,25.35 113.03,26.67 v113.03,72.39
N$30  (via drill 0.6)
  Top 0.406: v110.49,71.12 107.95,71.12 103.5,75.56 99.26,75.56 SW_11.1 SW_11.2 | SW_K.1 SW_K.2
  Bottom 0.406: IC7.2 82.55,73.66 85.09,76.2 85.09,78.74 88.9,82.55 94.82,82.55 SW_11.2 96.8,87.91 LED_11.A | SW_K.1 109.17,39.32 110.49,40.64 v110.49,71.12
N$31  (via drill 0.6)
  Top 0.406: IC6.9 49.53,64.77 74.93,64.77 v76.2,63.5
  Bottom 0.406: v76.2,63.5 76.2,61.59 85.09,61.59 IC7.14
N$32
  Top 0.406: SW_13.2 SW_13.1
  Bottom 0.406: IC7.4 87.63,73.66 90.17,76.2 90.17,80.64 90.81,81.28 111.33,81.28 SW_13.2 114.58,87.91 LED_13.A
N$34
  Top 0.406: SW_14.2 SW_14.1
  Bottom 0.406: IC7.5 90.17,74.93 90.81,75.56 90.81,80.01 91.44,80.64 114.94,80.64 116.84,82.55 121.49,82.55 SW_14.2 123.47,87.91 LED_14.A
N$35  (1 unrouted)
N$36
  Bottom 0.406: IC1.10 139.83,40.64 X1.2 144.65,39.5 C6.1
N$37
  Bottom 0.406: IC1.9 139.83,43.18 X1.1 144.65,44.32 C5.1
N$38  (1 unrouted)
  Bottom 0.406: S1.2 141.25,67.59 139.7,66.04 R9.2 IC1.1
N$39
  Top 0.406: SW_15.2 SW_15.1
  Bottom 0.406: IC7.6 92.71,74.93 93.34,75.56 114.94,75.56 116.84,77.47 116.84,81.28 117.47,81.92 131.44,81.92 132.36,82.83 SW_15.2 132.36,87.91 LED_15.A
N$40
  Top 0.406: SW_16.2 SW_16.1
  Bottom 0.406: IC7.7 95.25,74.3 95.89,74.93 115.57,74.93 117.47,76.83 117.47,80.64 118.11,81.28 138,81.28 SW_16.2 141.25,87.91 LED_16.A
N$43  (1 unrouted)
N$44  (1 unrouted)
N$46
  Bottom 0.406: SYNC_P5.1 D4.A 92.08,36.83 92.71,36.2 92.71,28.57 93.34,27.94 IC8.3
N$47
  Bottom 0.406: R21.2 D4.C 93.98,36.83 93.34,36.2 93.34,31.11 93.98,30.48 IC8.2
N$48
  Bottom 0.406: R12.2 124.46,40.01 125.09,40.64 IC1.19
N$49
  Bottom 0.406: SYNC_P4.1 R21.1
N$50
  Bottom 0.406: LED_AVROK.A 125.09,26.67 124.46,27.3 R12.1
N$51
  Bottom 0.406: R23.2 IC8.7
N$53
  Bottom 0.406: R24.1 83.82,8.26 84.45,7.62 LED4.K
N$54  (2 unrouted)
N$55  (1 unrouted)
N$57  (1 unrouted)
  Bottom 0.406: IC8.6 81.92,27.94 81.28,27.3 R22.1
N$58
  Bottom 0.406: LED4.A 92.71,13.34 93.34,13.97 IC9.3
N$59
  Bottom 0.406: ICSP3.1 71.12,3.81 71.75,3.17 94.61,3.17 95.25,3.81 IC9.4
N$60
  Bottom 0.406: IC8.5 84.45,25.4 83.82,24.77 R23.1
SR_CLK  (via drill 0.6)  (1 unrouted)
  Top 0.406: IC6.11 44.45,60.33 v72.39,60.33
  Bottom 0.406: IC7.11 IC7.12 90.17,60.33 v72.39,60.33 | IC6.11 IC6.12
SR_DAT  (1 unrouted)
SW_HOLD  (2 unrouted)
SYNCH_RESTART  (1 unrouted)
  Bottom 0.406: IC9.6 81.92,13.97 81.28,13.34 ICSP3.5
SYNCH_RUN  (1 unrouted)
  Bottom 0.406: IC9.7 79.38,16.51 78.74,15.88 ICSP3.4
SYNCH_TICK  (1 unrouted)
VCC  (10 unrouted)
  Top 0.406: R5.2 80.01,52.07 IC7.16 80.01,66.04 | 46.99,64.77 47.62,65.41 74.93,65.41 75.56,66.04 C11.1 80.01,66.04 | 46.99,64.77 IC6.10 | IC6.16 31.75,64.77 32.38,65.41 46.35,65.41 46.99,64.77 | IC7.10 95.25,64.77 93.98,66.04 80.01,66.04
  Bottom 0.406: IC6.16 31.75,64.77 30.48,66.04 C10.1 | R5.2 IC3.8 | R22.2 IC8.8 | C2.1 92.71,19.68 93.34,19.05 IC9.1 | R3.2 142.24,60.96 144.78,63.5 R9.1 | C12.1 IC1.21 | IC1.21 IC1.20 | IC1.7 133.35,48.26 130.81,45.72 IC1.21
VIN  (4 unrouted)